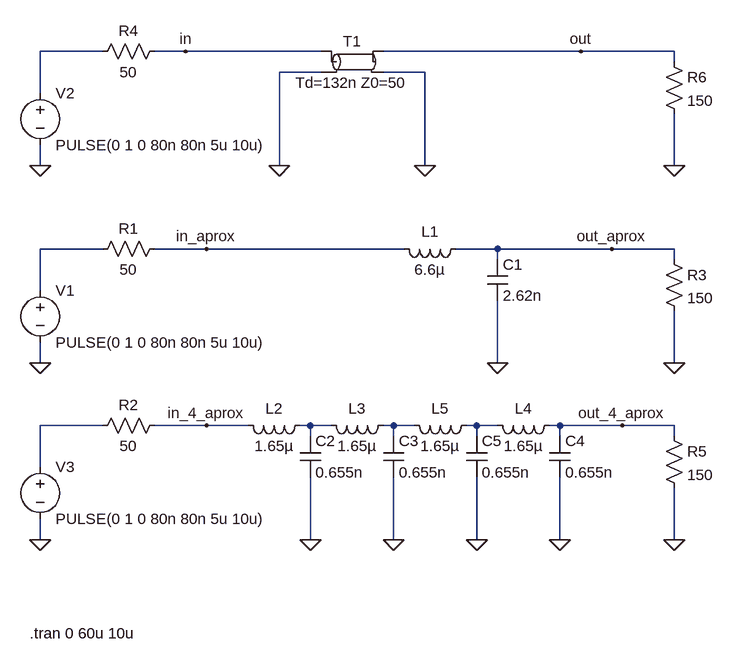
[diagram p0: schematic transmission_lines.asc]
transmission_lines.asc, the LTspice schematic file:
Version 4
SHEET 1 2276 680
WIRE 96 -576 0 -576
WIRE 224 -576 176 -576
WIRE 432 -576 224 -576
WIRE 832 -576 528 -576
WIRE 976 -576 832 -576
WIRE 976 -560 976 -576
WIRE 432 -544 368 -544
WIRE 592 -544 528 -544
WIRE 0 -512 0 -576
WIRE 0 -400 0 -432
WIRE 368 -400 368 -544
WIRE 592 -400 592 -544
WIRE 976 -400 976 -480
WIRE 96 -272 0 -272
WIRE 256 -272 176 -272
WIRE 560 -272 256 -272
WIRE 704 -272 640 -272
WIRE 880 -272 704 -272
WIRE 976 -272 880 -272
WIRE 704 -256 704 -272
WIRE 976 -256 976 -272
WIRE 0 -208 0 -272
WIRE 0 -96 0 -128
WIRE 704 -96 704 -192
WIRE 976 -96 976 -176
WIRE 96 0 0 0
WIRE 256 0 176 0
WIRE 320 0 256 0
WIRE 416 0 400 0
WIRE 448 0 416 0
WIRE 544 0 528 0
WIRE 576 0 544 0
WIRE 672 0 656 0
WIRE 704 0 672 0
WIRE 800 0 784 0
WIRE 896 0 800 0
WIRE 976 0 896 0
WIRE 416 16 416 0
WIRE 544 16 544 0
WIRE 672 16 672 0
WIRE 800 16 800 0
WIRE 976 16 976 0
WIRE 0 64 0 0
WIRE 0 176 0 144
WIRE 416 176 416 80
WIRE 544 176 544 80
WIRE 672 176 672 80
WIRE 800 176 800 80
WIRE 976 176 976 96
FLAG 0 -96 0
FLAG 704 -96 0
FLAG 976 -96 0
FLAG 0 -400 0
FLAG 976 -400 0
FLAG 368 -400 0
FLAG 592 -400 0
FLAG 256 -272 in_aprox
FLAG 880 -272 out_aprox
FLAG 224 -576 in
FLAG 832 -576 out
FLAG 0 176 0
FLAG 976 176 0
FLAG 256 0 in_4_aprox
FLAG 896 0 out_4_aprox
FLAG 544 176 0
FLAG 416 176 0
FLAG 800 176 0
FLAG 672 176 0
SYMBOL voltage 0 -224 R0
WINDOW 123 0 0 Left 0
WINDOW 39 0 0 Left 0
SYMATTR InstName V1
SYMATTR Value PULSE(0 1 0 80n 80n 5u 10u)
SYMBOL res 192 -288 R90
WINDOW 0 0 56 VBottom 2
WINDOW 3 32 56 VTop 2
SYMATTR InstName R1
SYMATTR Value 50
SYMBOL ind 656 -288 R90
WINDOW 0 5 56 VBottom 2
WINDOW 3 32 56 VTop 2
SYMATTR InstName L1
SYMATTR Value 6.6µ
SYMBOL cap 688 -256 R0
SYMATTR InstName C1
SYMATTR Value 2.62n
SYMBOL res 960 -272 R0
SYMATTR InstName R3
SYMATTR Value 150
SYMBOL tline 480 -560 R0
SYMATTR InstName T1
SYMATTR Value Td=132n Z0=50
SYMBOL voltage 0 -528 R0
WINDOW 123 0 0 Left 0
WINDOW 39 0 0 Left 0
SYMATTR InstName V2
SYMATTR Value PULSE(0 1 0 80n 80n 5u 10u)
SYMBOL res 192 -592 R90
WINDOW 0 0 56 VBottom 2
WINDOW 3 32 56 VTop 2
SYMATTR InstName R4
SYMATTR Value 50
SYMBOL res 960 -576 R0
SYMATTR InstName R6
SYMATTR Value 150
SYMBOL voltage 0 48 R0
WINDOW 123 0 0 Left 0
WINDOW 39 0 0 Left 0
SYMATTR InstName V3
SYMATTR Value PULSE(0 1 0 80n 80n 5u 10u)
SYMBOL res 192 -16 R90
WINDOW 0 0 56 VBottom 2
WINDOW 3 32 56 VTop 2
SYMATTR InstName R2
SYMATTR Value 50
SYMBOL res 960 0 R0
SYMATTR InstName R5
SYMATTR Value 150
SYMBOL ind 544 -16 R90
WINDOW 0 5 56 VBottom 2
WINDOW 3 32 56 VTop 2
SYMATTR InstName L3
SYMATTR Value 1.65µ
SYMBOL cap 528 16 R0
SYMATTR InstName C3
SYMATTR Value 0.655n
SYMBOL ind 416 -16 R90
WINDOW 0 5 56 VBottom 2
WINDOW 3 32 56 VTop 2
SYMATTR InstName L2
SYMATTR Value 1.65µ
SYMBOL cap 400 16 R0
SYMATTR InstName C2
SYMATTR Value 0.655n
SYMBOL ind 800 -16 R90
WINDOW 0 5 56 VBottom 2
WINDOW 3 32 56 VTop 2
SYMATTR InstName L4
SYMATTR Value 1.65µ
SYMBOL cap 784 16 R0
SYMATTR InstName C4
SYMATTR Value 0.655n
SYMBOL ind 672 -16 R90
WINDOW 0 5 56 VBottom 2
WINDOW 3 32 56 VTop 2
SYMATTR InstName L5
SYMATTR Value 1.65µ
SYMBOL cap 656 16 R0
SYMATTR InstName C5
SYMATTR Value 0.655n
TEXT -16 320 Left 2 !.tran 0 60u 10u

The netlist it stands for:
* transmission_lines.asc
V1 N002 0 PULSE(0 1 0 80n 80n 5u 10u)
R1 in_aprox N002 50
L1 out_aprox in_aprox 6.6µ
C1 out_aprox 0 2.62n
R3 out_aprox 0 150
T1 in 0 out 0 Td=132n Z0=50
V2 N001 0 PULSE(0 1 0 80n 80n 5u 10u)
R4 in N001 50
R6 out 0 150
V3 N003 0 PULSE(0 1 0 80n 80n 5u 10u)
R2 in_4_aprox N003 50
R5 out_4_aprox 0 150
L3 N005 N004 1.65µ
C3 N005 0 0.655n
L2 N004 in_4_aprox 1.65µ
C2 N004 0 0.655n
L4 out_4_aprox N006 1.65µ
C4 out_4_aprox 0 0.655n
L5 N006 N005 1.65µ
C5 N006 0 0.655n
.tran 0 60u 10u
.backanno
.end